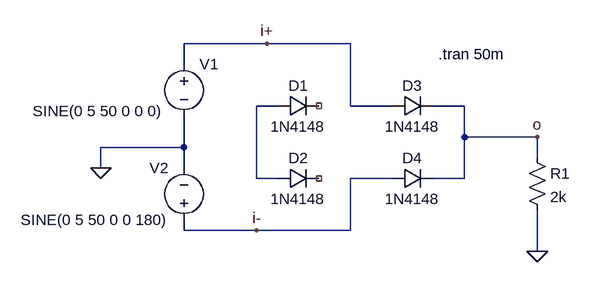
[diagram p0: schematic fig1a.asc]
fig1a.asc, the LTspice schematic file:
Version 4
SHEET 1 880 680
WIRE 272 16 144 16
WIRE 400 16 272 16
WIRE 144 48 144 16
WIRE 288 112 256 112
WIRE 400 112 400 16
WIRE 464 112 400 112
WIRE 576 112 528 112
WIRE 576 160 576 112
WIRE 688 160 576 160
WIRE 144 176 144 128
WIRE 144 176 16 176
WIRE 688 192 688 160
WIRE 16 208 16 176
WIRE 144 208 144 176
WIRE 256 224 256 112
WIRE 288 224 256 224
WIRE 464 224 400 224
WIRE 576 224 576 160
WIRE 576 224 528 224
WIRE 144 304 144 288
WIRE 256 304 144 304
WIRE 400 304 400 224
WIRE 400 304 256 304
WIRE 688 336 688 272
FLAG 16 208 0
FLAG 688 336 0
FLAG 256 304 i-
FLAG 272 16 i+
FLAG 688 160 o
SYMBOL voltage 144 32 R0
WINDOW 3 -233 88 Left 2
WINDOW 123 0 0 Left 0
WINDOW 39 0 0 Left 0
SYMATTR Value SINE(0 5 50 0 0 0)
SYMATTR InstName V1
SYMBOL voltage 144 304 R180
WINDOW 0 24 96 Left 2
WINDOW 3 24 16 Left 2
WINDOW 123 0 0 Left 0
WINDOW 39 0 0 Left 0
SYMATTR InstName V2
SYMATTR Value SINE(0 5 50 0 0 180)
SYMBOL diode 288 128 R270
WINDOW 0 32 32 VTop 2
WINDOW 3 0 32 VBottom 2
SYMATTR InstName D1
SYMATTR Value 1N4148
SYMBOL diode 288 240 R270
WINDOW 0 32 32 VTop 2
WINDOW 3 0 32 VBottom 2
SYMATTR InstName D2
SYMATTR Value 1N4148
SYMBOL diode 464 128 R270
WINDOW 0 32 32 VTop 2
WINDOW 3 0 32 VBottom 2
SYMATTR InstName D3
SYMATTR Value 1N4148
SYMBOL diode 464 240 R270
WINDOW 0 32 32 VTop 2
WINDOW 3 0 32 VBottom 2
SYMATTR InstName D4
SYMATTR Value 1N4148
SYMBOL res 672 176 R0
SYMATTR InstName R1
SYMATTR Value 2k
TEXT 536 32 Left 2 !.tran 50m

The netlist it stands for:
* fig1a.asc
V1 i+ 0 SINE(0 5 50 0 0 0)
V2 i- 0 SINE(0 5 50 0 0 180)
D1 N001 NC_01 1N4148
D2 N001 NC_02 1N4148
D3 i+ o 1N4148
D4 i- o 1N4148
R1 o 0 2k
.model D D
.lib standard.dio
.tran 50m
.backanno
.end

* Results of the author's LTspice run, read from the files saved beside the schematic
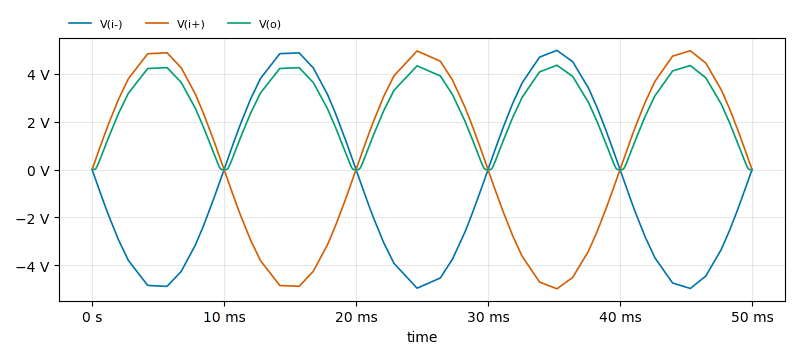
[diagram p1: Transient Analysis of fig1a.asc, plotted from the saved traces]
* Transient Analysis, 1 run:
*   V(i-): min -4.974 V, max 4.988 V, average -626.5 mV, rms 3.502 V, last 0 V
*   V(i+): min -4.988 V, max 4.974 V, average 626.5 mV, rms 3.502 V, last 0 V
*   V(o): min 0 V, max 4.367 V, average 2.579 V, rms 2.967 V, last 482.7 nV